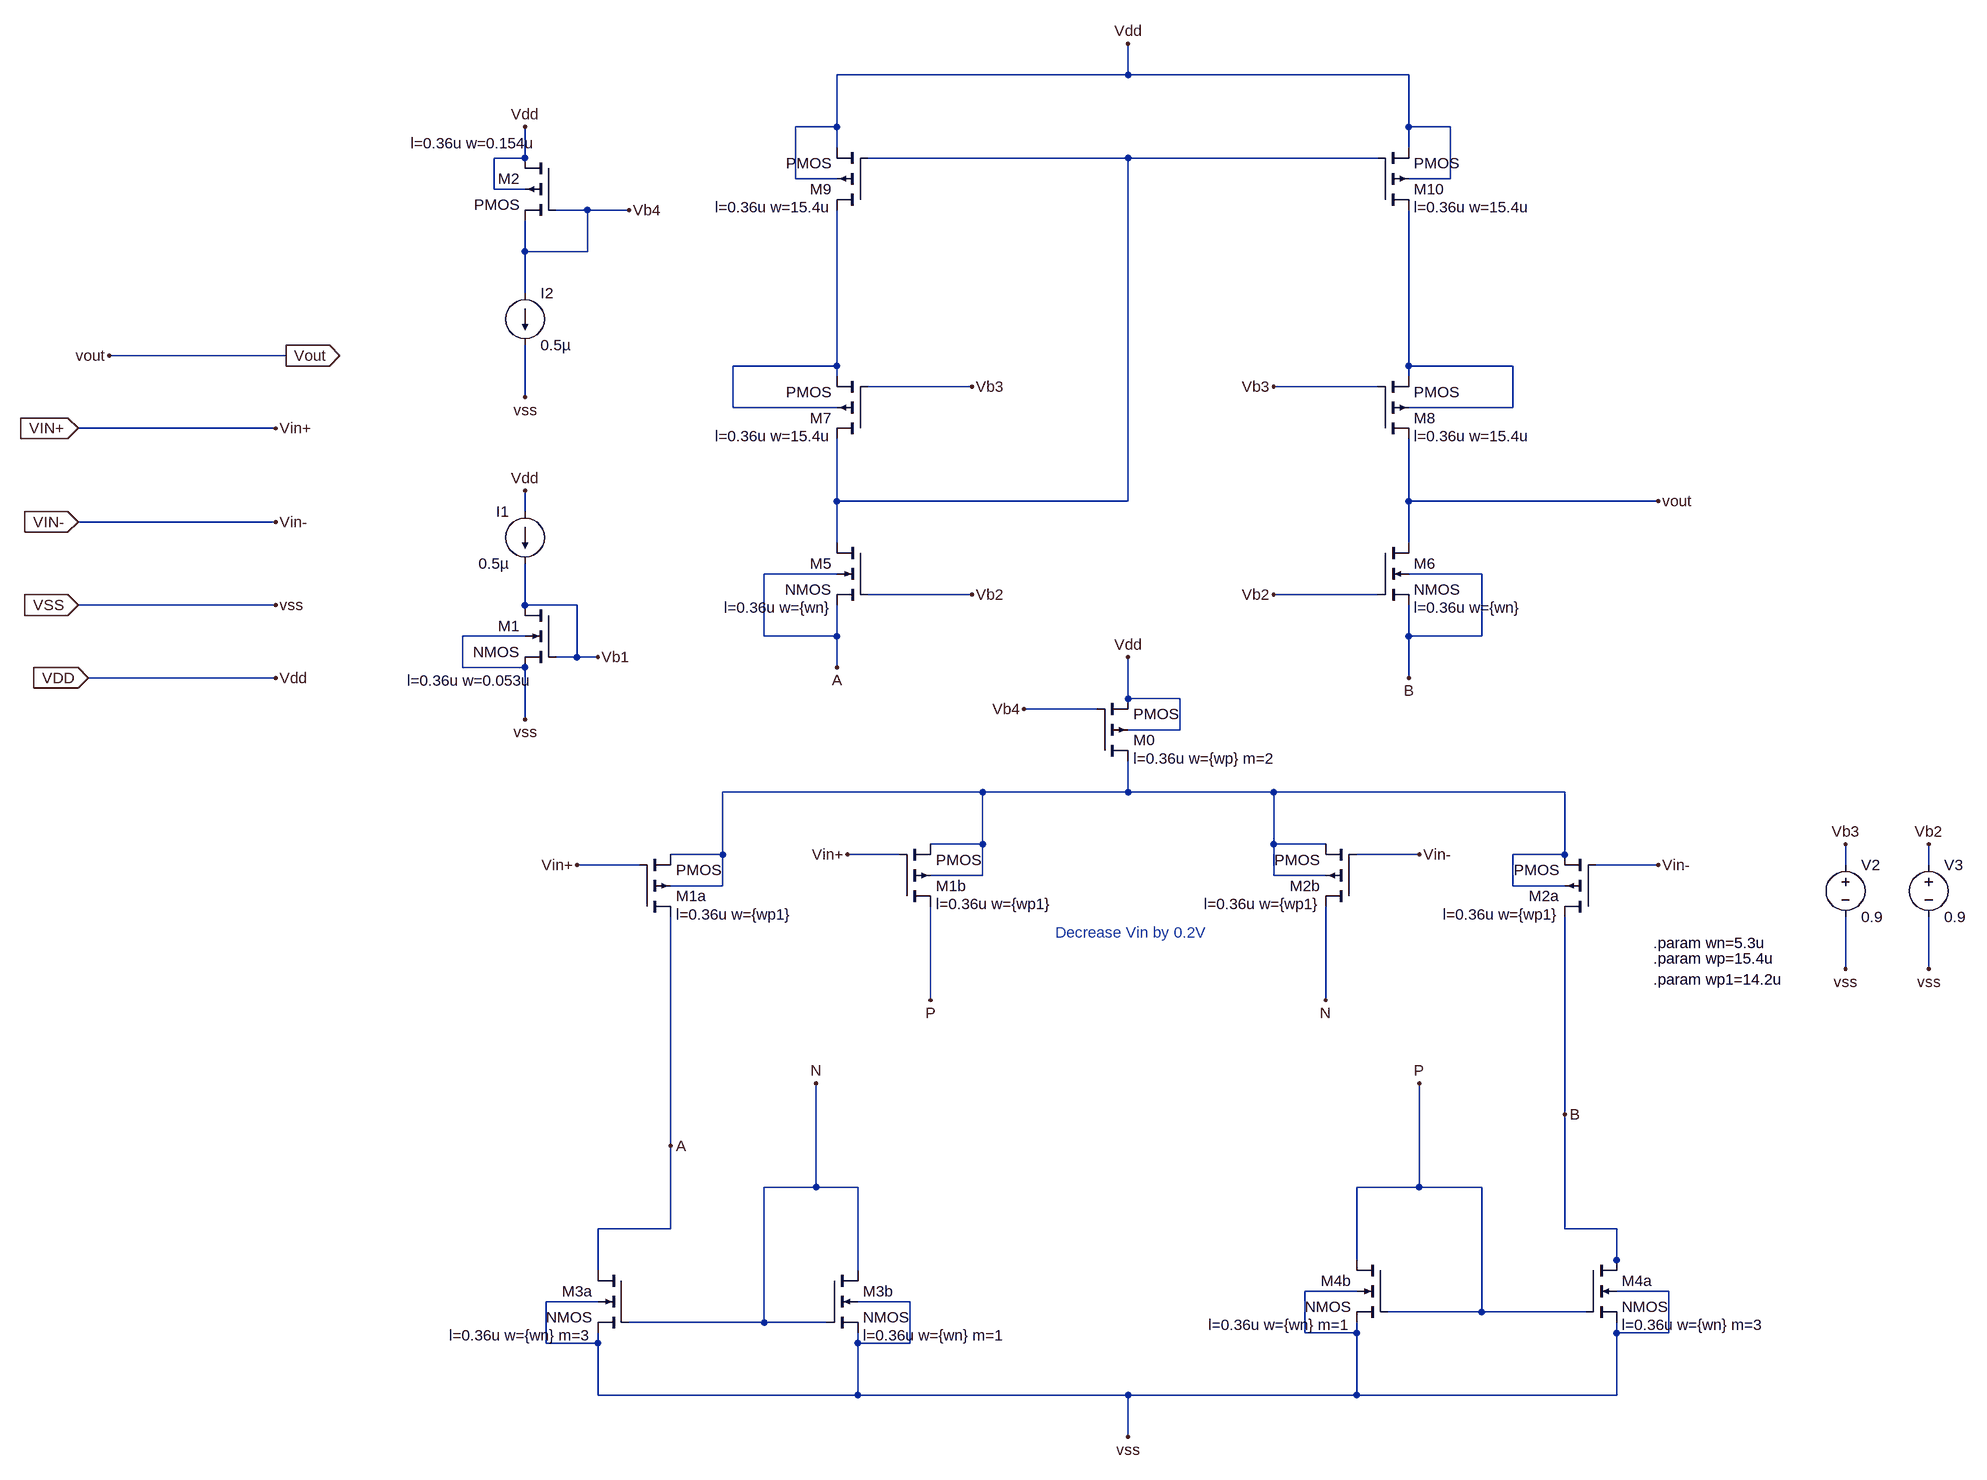
[diagram p0: schematic Error_amp.asc]
Error_amp.asc, the LTspice schematic file:
Version 4
SHEET 1 4352 1320
WIRE -896 -1344 -896 -1392
WIRE -896 -1344 -1344 -1344
WIRE -464 -1344 -896 -1344
WIRE -1344 -1264 -1344 -1344
WIRE -1344 -1264 -1408 -1264
WIRE -464 -1264 -464 -1344
WIRE -400 -1264 -464 -1264
WIRE -1344 -1232 -1344 -1264
WIRE -464 -1232 -464 -1264
WIRE -1824 -1216 -1824 -1264
WIRE -1824 -1216 -1872 -1216
WIRE -896 -1216 -1296 -1216
WIRE -512 -1216 -896 -1216
WIRE -1408 -1184 -1408 -1264
WIRE -1344 -1184 -1408 -1184
WIRE -400 -1184 -400 -1264
WIRE -400 -1184 -464 -1184
WIRE -1872 -1168 -1872 -1216
WIRE -1824 -1168 -1872 -1168
WIRE -1728 -1136 -1776 -1136
WIRE -1664 -1136 -1728 -1136
WIRE -1824 -1072 -1824 -1120
WIRE -1728 -1072 -1728 -1136
WIRE -1728 -1072 -1824 -1072
WIRE -1824 -1008 -1824 -1072
WIRE -2192 -912 -2464 -912
WIRE -1344 -896 -1344 -1136
WIRE -1344 -896 -1504 -896
WIRE -464 -896 -464 -1136
WIRE -304 -896 -464 -896
WIRE -1344 -880 -1344 -896
WIRE -464 -880 -464 -896
WIRE -1136 -864 -1296 -864
WIRE -512 -864 -672 -864
WIRE -1824 -848 -1824 -928
WIRE -1504 -832 -1504 -896
WIRE -1344 -832 -1504 -832
WIRE -304 -832 -304 -896
WIRE -304 -832 -464 -832
WIRE -2208 -800 -2512 -800
WIRE -1344 -688 -1344 -784
WIRE -896 -688 -896 -1216
WIRE -896 -688 -1344 -688
WIRE -464 -688 -464 -784
WIRE -80 -688 -464 -688
WIRE -1824 -672 -1824 -704
WIRE -2208 -656 -2512 -656
WIRE -1344 -624 -1344 -688
WIRE -464 -624 -464 -688
WIRE -1344 -576 -1456 -576
WIRE -352 -576 -464 -576
WIRE -1136 -544 -1296 -544
WIRE -512 -544 -672 -544
WIRE -2208 -528 -2512 -528
WIRE -1824 -528 -1824 -592
WIRE -1744 -528 -1824 -528
WIRE -1824 -480 -1920 -480
WIRE -1456 -480 -1456 -576
WIRE -1344 -480 -1344 -528
WIRE -1344 -480 -1456 -480
WIRE -464 -480 -464 -528
WIRE -352 -480 -352 -576
WIRE -352 -480 -464 -480
WIRE -1744 -448 -1744 -528
WIRE -1744 -448 -1776 -448
WIRE -1712 -448 -1744 -448
WIRE -1920 -432 -1920 -480
WIRE -1824 -432 -1920 -432
WIRE -1344 -432 -1344 -480
WIRE -2208 -416 -2496 -416
WIRE -464 -416 -464 -480
WIRE -896 -384 -896 -448
WIRE -816 -384 -896 -384
WIRE -944 -368 -1056 -368
WIRE -1824 -352 -1824 -432
WIRE -816 -336 -816 -384
WIRE -816 -336 -896 -336
WIRE -1120 -240 -1520 -240
WIRE -896 -240 -896 -288
WIRE -896 -240 -1120 -240
WIRE -672 -240 -896 -240
WIRE -224 -240 -672 -240
WIRE -1120 -160 -1120 -240
WIRE -1120 -160 -1200 -160
WIRE -672 -160 -672 -240
WIRE -592 -160 -672 -160
WIRE -1520 -144 -1520 -240
WIRE -1520 -144 -1600 -144
WIRE -1248 -144 -1328 -144
WIRE -448 -144 -544 -144
WIRE -224 -144 -224 -240
WIRE -224 -144 -304 -144
WIRE -1648 -128 -1744 -128
WIRE -80 -128 -176 -128
WIRE 208 -128 208 -160
WIRE 336 -128 336 -160
WIRE -1120 -112 -1120 -160
WIRE -1120 -112 -1200 -112
WIRE -672 -112 -672 -160
WIRE -592 -112 -672 -112
WIRE -1520 -96 -1520 -144
WIRE -1520 -96 -1600 -96
WIRE -304 -96 -304 -144
WIRE -224 -96 -304 -96
WIRE 208 32 208 -48
WIRE 336 32 336 -48
WIRE -1200 80 -1200 -64
WIRE -592 80 -592 -64
WIRE -224 256 -224 -48
WIRE -1600 304 -1600 -48
WIRE -1376 368 -1376 208
WIRE -1376 368 -1456 368
WIRE -1312 368 -1376 368
WIRE -448 368 -448 208
WIRE -448 368 -544 368
WIRE -352 368 -448 368
WIRE -1600 432 -1600 304
WIRE -1600 432 -1712 432
WIRE -224 432 -224 256
WIRE -144 432 -224 432
WIRE -544 480 -544 368
WIRE -144 480 -144 432
WIRE -1712 496 -1712 432
WIRE -1312 496 -1312 368
WIRE -144 496 -144 480
WIRE -544 528 -624 528
WIRE -64 528 -144 528
WIRE -1712 544 -1792 544
WIRE -1232 544 -1312 544
WIRE -352 560 -352 368
WIRE -352 560 -496 560
WIRE -192 560 -352 560
WIRE -1456 576 -1456 368
WIRE -1456 576 -1664 576
WIRE -1360 576 -1456 576
WIRE -624 592 -624 528
WIRE -544 592 -544 576
WIRE -544 592 -624 592
WIRE -144 592 -144 576
WIRE -64 592 -64 528
WIRE -64 592 -144 592
WIRE -1792 608 -1792 544
WIRE -1712 608 -1712 592
WIRE -1712 608 -1792 608
WIRE -1312 608 -1312 592
WIRE -1232 608 -1232 544
WIRE -1232 608 -1312 608
WIRE -1712 688 -1712 608
WIRE -1312 688 -1312 608
WIRE -1312 688 -1712 688
WIRE -896 688 -1312 688
WIRE -544 688 -544 592
WIRE -544 688 -896 688
WIRE -144 688 -144 592
WIRE -144 688 -544 688
WIRE -896 752 -896 688
FLAG -1712 -448 Vb1
FLAG -1824 -704 Vdd
FLAG -1824 -1264 Vdd
FLAG -1664 -1136 Vb4
FLAG -1136 -864 Vb3
FLAG -1136 -544 Vb2
FLAG 208 -160 Vb3
FLAG 336 -160 Vb2
FLAG -1744 -128 Vin+
FLAG -896 -1392 Vdd
FLAG -672 -864 Vb3
FLAG -672 -544 Vb2
FLAG -80 -128 Vin-
FLAG -1056 -368 Vb4
FLAG -896 -448 Vdd
FLAG -1344 -432 A
FLAG -1600 304 A
FLAG -224 256 B
FLAG -464 -416 B
FLAG -1376 208 N
FLAG -592 80 N
FLAG -1200 80 P
FLAG -448 208 P
FLAG -1328 -144 Vin+
FLAG -448 -144 Vin-
FLAG -80 -688 vout
FLAG -2192 -912 Vout
IOPIN -2192 -912 Out
FLAG -2512 -800 VIN+
IOPIN -2512 -800 In
FLAG -2512 -656 VIN-
IOPIN -2512 -656 In
FLAG -2512 -528 VSS
IOPIN -2512 -528 In
FLAG -2496 -416 VDD
IOPIN -2496 -416 In
FLAG -2208 -416 Vdd
FLAG -2208 -800 Vin+
FLAG -2208 -656 Vin-
FLAG -2464 -912 vout
FLAG -1824 -352 vss
FLAG -1824 -848 vss
FLAG -2208 -528 vss
FLAG -896 752 vss
FLAG 208 32 vss
FLAG 336 32 vss
DATAFLAG -1344 -960 ""
DATAFLAG -208 -688 ""
DATAFLAG -464 -960 ""
SYMBOL nmos4 -1776 -528 M0
WINDOW 123 37 116 Left 2
SYMATTR Value2 l=0.36u w=0.053u
SYMATTR InstName M1
SYMBOL current -1824 -672 M0
WINDOW 123 0 0 Left 0
WINDOW 39 0 0 Left 0
SYMATTR InstName I1
SYMATTR Value 0.5µ
SYMBOL pmos4 -1776 -1216 M0
WINDOW 123 31 -23 Left 2
SYMATTR Value2 l=0.36u w=0.154u
SYMATTR InstName M2
SYMBOL current -1824 -1008 R0
WINDOW 123 0 0 Left 0
WINDOW 39 0 0 Left 0
SYMATTR InstName I2
SYMATTR Value 0.5µ
SYMBOL pmos4 -1296 -1136 R180
WINDOW 123 56 4 Left 2
SYMATTR Value2 l=0.36u w=15.4u
SYMATTR InstName M9
SYMBOL pmos4 -1296 -784 R180
WINDOW 123 56 4 Left 2
SYMATTR Value2 l=0.36u w=15.4u
SYMATTR InstName M7
SYMBOL nmos4 -1296 -624 M0
WINDOW 123 56 100 Left 2
SYMATTR Value2 l=0.36u w={wn}
SYMATTR InstName M5
SYMBOL nmos4 -1360 496 R0
WINDOW 123 56 100 Left 2
SYMATTR Value2 l=0.36u w={wn} m=1
SYMATTR InstName M3b
SYMBOL voltage 208 -144 R0
WINDOW 123 0 0 Left 0
WINDOW 39 0 0 Left 0
SYMATTR InstName V2
SYMATTR Value 0.9
SYMBOL voltage 336 -144 R0
WINDOW 123 0 0 Left 0
WINDOW 39 0 0 Left 0
SYMATTR InstName V3
SYMATTR Value 0.9
SYMBOL pmos4 -1648 -48 M180
WINDOW 123 56 4 Left 2
SYMATTR Value2 l=0.36u w={wp1}
SYMATTR InstName M1a
SYMBOL pmos4 -512 -1136 M180
WINDOW 123 56 4 Left 2
SYMATTR Value2 l=0.36u w=15.4u
SYMATTR InstName M10
SYMBOL pmos4 -512 -784 M180
WINDOW 123 56 4 Left 2
SYMATTR Value2 l=0.36u w=15.4u
SYMATTR InstName M8
SYMBOL nmos4 -512 -624 R0
WINDOW 123 56 100 Left 2
SYMATTR Value2 l=0.36u w={wn}
SYMATTR InstName M6
SYMBOL nmos4 -496 480 M0
WINDOW 123 56 100 Left 2
SYMATTR Value2 l=0.36u w={wn} m=1
SYMATTR InstName M4b
SYMBOL pmos4 -176 -48 R180
WINDOW 123 56 4 Left 2
SYMATTR Value2 l=0.36u w={wp1}
SYMATTR InstName M2a
SYMBOL pmos4 -944 -288 M180
WINDOW 123 56 4 Left 2
SYMATTR Value2 l=0.36u w={wp} m=2
SYMATTR InstName M0
SYMATTR Prefix M0
SYMBOL pmos4 -1248 -64 M180
WINDOW 123 56 4 Left 2
SYMATTR Value2 l=0.36u w={wp1}
SYMATTR InstName M1b
SYMBOL nmos4 -1664 496 M0
WINDOW 123 56 100 Left 2
SYMATTR Value2 l=0.36u w={wn} m=3
SYMATTR InstName M3a
SYMBOL pmos4 -544 -64 R180
WINDOW 123 56 4 Left 2
SYMATTR Value2 l=0.36u w={wp1}
SYMATTR InstName M2b
SYMBOL nmos4 -192 480 R0
WINDOW 123 56 100 Left 2
SYMATTR Value2 l=0.36u w={wn} m=3
SYMATTR InstName M4a
TEXT -88 -8 Left 2 !.param wn=5.3u
TEXT -88 16 Left 2 !.param wp=15.4u
TEXT -88 48 Left 2 !.param wp1=14.2u
TEXT -1008 -24 Left 2 ;Decrease Vin by 0.2V

The netlist it stands for:
* Error_amp.asc
M1 Vb1 Vb1 VSS VSS NMOS l=0.36u w=0.053u
I1 Vdd Vb1 0.5µ
M2 Vdd Vb4 Vb4 Vdd PMOS l=0.36u w=0.154u
I2 Vb4 VSS 0.5µ
M9 N002 N001 Vdd Vdd PMOS l=0.36u w=15.4u
M7 N001 Vb3 N002 N002 PMOS l=0.36u w=15.4u
M5 N001 Vb2 A A NMOS l=0.36u w={wn}
M3b N N VSS VSS NMOS l=0.36u w={wn} m=1
V2 Vb3 VSS 0.9
V3 Vb2 VSS 0.9
M1a A Vin+ N004 N004 PMOS l=0.36u w={wp1}
M10 N003 N001 Vdd Vdd PMOS l=0.36u w=15.4u
M8 vout Vb3 N003 N003 PMOS l=0.36u w=15.4u
M6 vout Vb2 B B NMOS l=0.36u w={wn}
M4b P P VSS VSS NMOS l=0.36u w={wn} m=1
M2a B Vin- N004 N004 PMOS l=0.36u w={wp1}
M0 N004 Vb4 Vdd Vdd PMOS l=0.36u w={wp} m=2
M1b P Vin+ N004 N004 PMOS l=0.36u w={wp1}
M3a A N VSS VSS NMOS l=0.36u w={wn} m=3
M2b N Vin- N004 N004 PMOS l=0.36u w={wp1}
M4a B P VSS VSS NMOS l=0.36u w={wn} m=3
.model NMOS NMOS
.model PMOS PMOS
.lib standard.mos
.param wn=5.3u
.param wp=15.4u
.param wp1=14.2u
* Decrease Vin by 0.2V
.backanno
.end